# EAGLE design main (EAGLE 9.6.2)
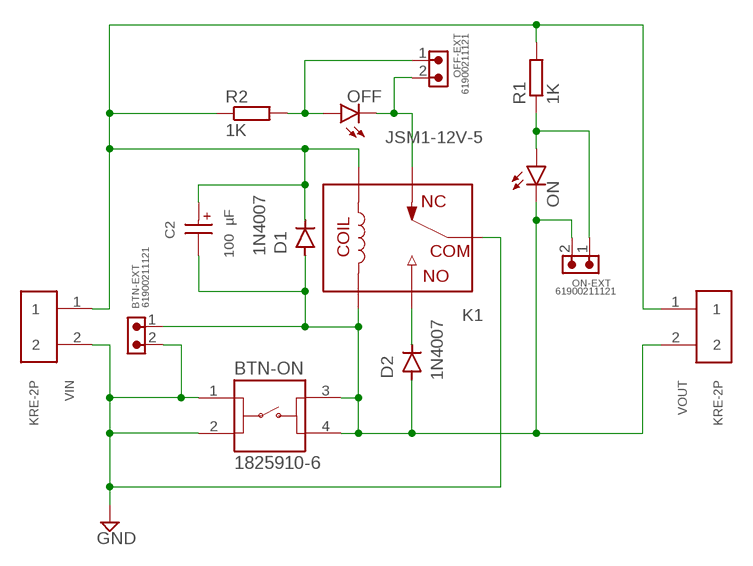
[diagram p0: schematic, sheet 1]

## Parts
BTN-EXT  61900211121  61900211121  [61900211121]
BTN-ON  1825910-6  [1825910-6]
C2  100 µF  WCAP-ATLL_5X11_860160372011  [WCAP-ATLL_5X11(DXL)]
D1  1N4007  [DO-41]
D2  1N4007  [DO-41]
K1  JSM1-12V-5  [JSM1-12V-5]
OFF  LED-CIRCULAR-3MM-VERMELHO  [LED-CIR-3MM-VERMELHO]
OFF-EXT  61900211121  61900211121  [61900211121]
ON  LED-CIRCULAR-3MM-VERDE  [LED-CIR-3MM-VERDE]
ON-EXT  61900211121  61900211121  [61900211121]
R1  1K  R-EU_0207/7  [0207/7]
R2  1K  R-EU_0207/7  [0207/7]
VIN  KRE-2P  [KRE-2P]
VOUT  KRE-2P  [KRE-2P]

## Nets
GND: BTN-EXT.2 BTN-ON.1 BTN-ON.2 K1.1 VIN.2
N$1: BTN-EXT.1 BTN-ON.3 BTN-ON.4 C2.2(-) D1.A D2.A K1.2 ON-EXT.2 ON.K(CATHODE) VOUT.2
N$2: OFF-EXT.1 OFF.A(ANODE) R2.2
N$3: C2.1(+) D1.C K1.5 R1.2 R2.1 VIN.1 VOUT.1
N$4: K1.4 OFF-EXT.2 OFF.K(CATHODE)
N$5: ON-EXT.1 ON.A(ANODE) R1.1
N$6: D2.C K1.3

## Library data of the parts
BTN-EXT OFF-EXT ON-EXT = Wurth_Connectors_WR-WTB:61900211121: WR-WTB 2.54 mm Male Locking Header KIND PROPERTIES: Pitch:2.54 mm Gender:Male MATERIAL PROPERTIES: Insulator Material :PA66 Insulator Flammability Rating:UL94 V-0 Insulator Color:Beige Contact Material:Copper Alloy Contact Plating:Tin Contact Type:Stamped GENERAL INFORMATION Operating Temperature:-40 up to +105 °C Compliance: RoHS Working Voltage:250 V (AC) Withstanding Voltage:1000 V (AC) Contact Resistance:20 mΩ RISO:1000 MΩ CERTIFICATION UL Approval:E323964 PACKAGING PROPERTIES Packaging:Bag <https://katalog.we-online.com/media/images/v2/o33345v209%20Family_WR-WTB_6190xx11121.jpg> Details see: https://katalog.we-online.com/en/em/WTB_2_54_MALE_LOCKING_HEADER_6190XX11121 Updated by Ella Wu 2020-07-08 2020 (C) Würth Elektronik; CONTACT-RESISTANCE: 20mOhm; DATASHEET-URL: https://www.we-online.com/catalog/datasheet/61900211121.pdf; GENDER: Male; L: 5.08mm; MOUNT: THT; PACKAGING: Bag; PART-NUMBER: 61900211121; PCB-CABLE-PANEL: PCB; PINS: 2; PITCH: 2.54mm; TOL-R: max.; TYPE: Vertical; USE-WITH: WR-WTB 2.54 mm Female Terminal Housing; WORKING-VOLTAGE: 250V(AC)
BTN-ON = Switch:1825910-6: SWITCH TACTILE SPST-NO 0.05A 24V Manufacturer's datasheet <https://www.te.com/commerce/DocumentDelivery/DDEController?Action=srchrtrv&DocNm=1825910&DocType=Customer+Drawing&DocLang=English>; CREATED_BY: PCBLayout.com; DIGIKEY_PART_NUMBER: 450-1650-ND; MANUFACTURER: TE Connectivity ALCOSWITCH Switches; MPN: 1825910-6
C2 = Wurth_Capacitors_WCAP-ATLL:WCAP-ATLL_5X11: WCAP-ATLL Aluminum Electrolytic Capacitors Long Life +105 °C Characteristics Long life product series Mounting style: THT Radial Capacitance range: 0.47 µF ‒ 6800 µF Capacitance tolerance: ±20 % Voltage range (UR): 10 ‒ 50 V(DC) Operating temperature: -55 °C up to +105 °C Endurance: 3000 ‒ 10000 h @ +105 °C Dimensions (DxL) in mm: 5.0 x 11.0 up to 18.0 x 35.5 Recommended soldering: Wave soldering Applications Long life application Filtering Smoothing Energy storage Coupling e.g. Switched-mode power supply, AC/DC converter, adapter, charger, digital camera <https://www.we-online.com/catalog/media/o14730v209%20Family_WCAP-ATLL.jpg> Details see: https://www.we-online.com/catalog/en/WCAP-ATLL/ Updated by yingchun,Shan;2020-03-02 2020(C) Würth Elektronik; DATASHEET-URL: https://www.we-online.com/catalog/datasheet/860160372011.pdf; DF: 16%; DIAMETER: 5mm; I-LEAK: 16uA; I-RIPPLE: 228mA; L: 11mm; OPERATING-TEMPERATURE: -55 °C up to +105 °C; PART-NUMBER: 860160372011; PITCH: 2mm; TECHNICAL-REFERENCE: ATEC110101M016DSPA3C000; VR: 16V(DC)
D1 D2 = Diodes:1N4007: DIODE GEN PURP 1KV 1A DO41 Manufacturer's datasheet <https://www.mccsemi.com/pdf/Products/1N4001-1N4007(DO-41).pdf>; CREATED_BY: PCBLayout.com; DIGIKEY_PART_NUMBER: 1N4007MSCT-ND; MANUFACTURER: Micro Commercial Co; MPN: 1N4007; PACKAGE: DO-41
K1 = Relay:JSM1-12V-5: RELAY AUTOMOTIVE SPDT 15A 12V Manufacturer's datasheet <https://media.digikey.com/pdf/Data%20Sheets/Panasonic%20Electric%20Works%20PDFs/JS-M_Series_Rev_Dec_2011.pdf>; CREATED_BY: PCBLayout.com; DIGIKEY_PARTNO: 255-1240-ND; MANUFACTURER: Panasonic Electric Works; MPN: JSM1-12V-5
OFF ON = LED:LED-CIRCULAR-3MM
R1 R2 = resistor:R-EU_: RESISTOR, European symbol
VIN VOUT = kre:KRE-2P: KRE Conector 2P

## Board
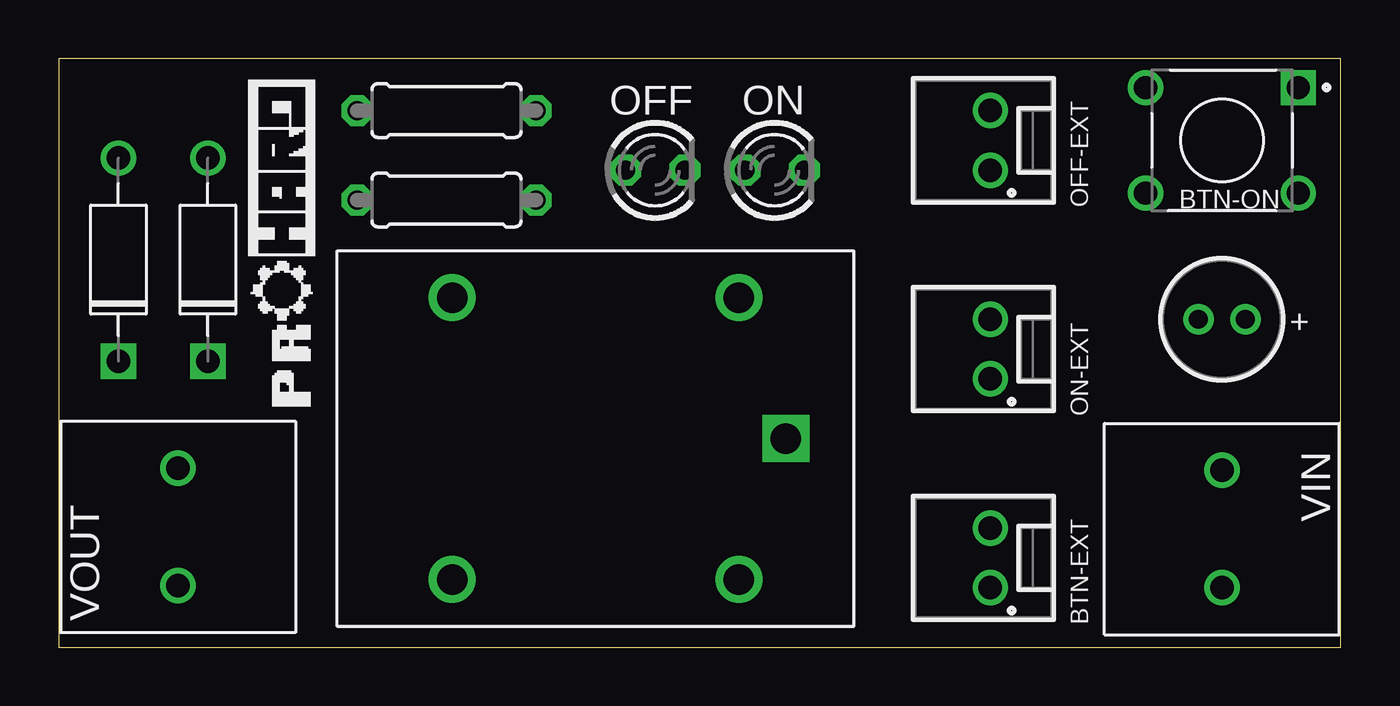
[diagram p1: board, top side]
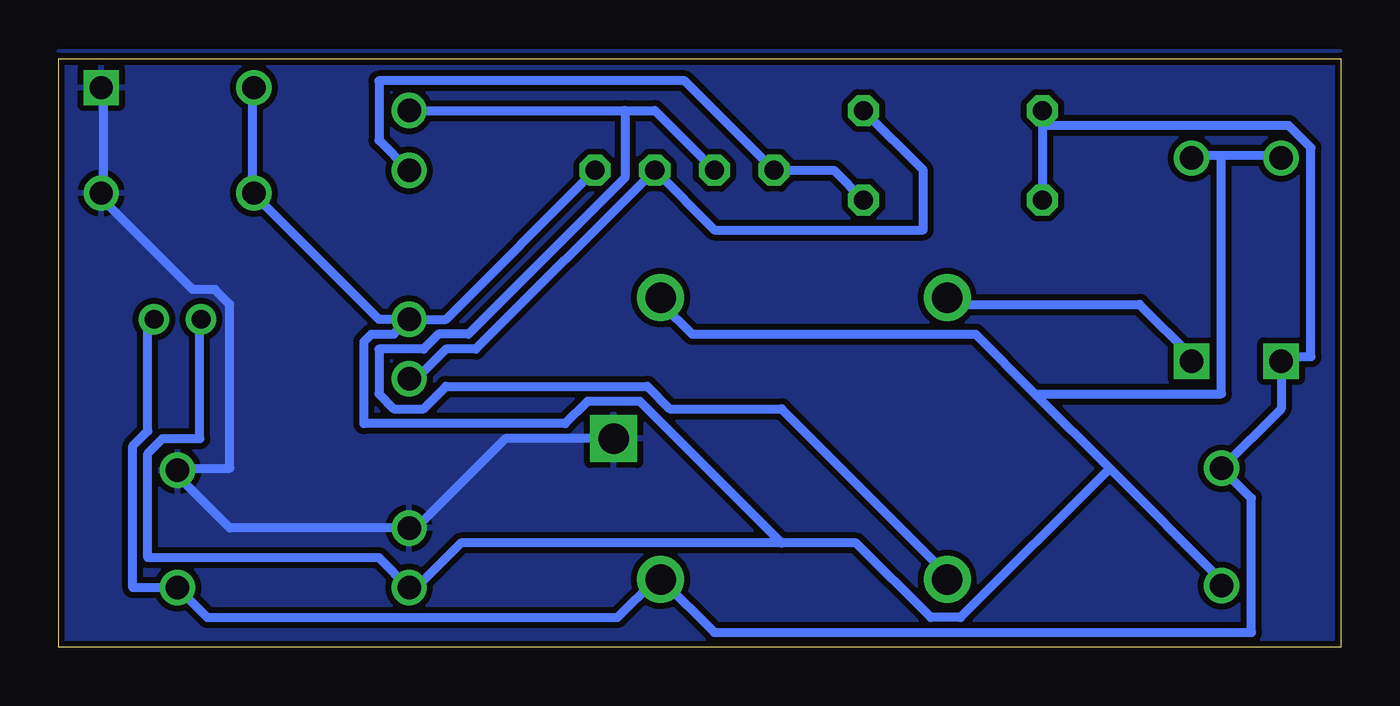
[diagram p2: board, bottom side, seen from below]

Size 54.59 x 25.07 mm. Coordinates in mm from the lower left corner, seen from the top.
Outline: 0,0 54.59,0 54.59,25.07 0,25.07 0,0
Copper layers (1*16): Top 0.035mm / dielectric 1.5mm / Bottom 0.035mm
Design rules "default *": minimum track width 15mil, minimum drill 0.35mm, track to track 10mil, track to pad 10mil, pad to pad 10mil, via to via 10mil, smd to smd 6mil, copper to edge 10mil, drill to drill 10mil, minimum pad ring 10mil, minimum via ring 8mil, stop-mask expansion 4mil, vias tented up to drill 0mil, thermal gap 10mil

### Footprints (pad centres in the part's own frame; a part is rotated, then mirrored left to right if it is on the bottom)
61900211121 = drill 1: 1 1.27,0.3; 2 -1.27,0.3
1825910-6 = drill 0.99 square: 1 3.25,2.25 | drill 0.99: 2 3.25,-2.25; 3 -3.25,2.25; 4 -3.25,-2.25
WCAP-ATLL_5X11(DXL) = drill 0.8: 1 1,0; 2 -1,0
DO-41 = drill 1: A 4.325,0 | drill 1 square: C -4.325,0
JSM1-12V-5 = drill 1.3 pad 2 square: 1 8.1,0 | drill 1.3 pad 2: 2 6.1,6; 3 -6.1,6; 4 -6.1,-6; 5 6.1,-6
LED-CIR-3MM-VERMELHO = drill 0.813 octagon: A -1.27,0; K 1.27,0
LED-CIR-3MM-VERDE = drill 0.813 octagon: A -1.27,0; K 1.27,0
0207/7 = drill 0.813 octagon: 1 -3.81,0; 2 3.81,0
KRE-2P = drill 1: 1 -2.54,0; 2 2.46,0

### Placement (x,y rotation side)
BTN-EXT  39.37,3.81 270 top
BTN-ON  49.53,21.59 0 top
C2  49.53,13.97 0 top
D1  2.54,16.51 90 top
D2  6.35,16.51 90 top
K1  22.86,8.89 0 top
OFF  25.4,20.32 0 top
OFF-EXT  39.37,21.59 270 top
ON  30.48,20.32 0 top
ON-EXT  39.37,12.7 270 top
R1  16.51,22.86 180 top
R2  16.51,19.05 0 top
VIN  49.53,5.08 90 top
VOUT  5.08,5.08 270 top

### Tracks (layer width: path | path; a pad name or v marks a point on that pad's centre or on a via)
GND
  Bottom 0.381: BTN-ON.1 52.7,23.81 52.7,19.37 BTN-ON.2 52.7,19.05 48.9,15.24 47.94,15.24 47.31,14.61 47.31,7.62 49.53,7.62 VIN.2 49.53,7.3 47.31,5.08 BTN-EXT.2 39.37,5.08 35.56,8.89 K1.1
  pour Bottom: 0,25.4 54.61,25.4 54.61,0 0,0
N$1
  Bottom 0.381: BTN-ON.3 46.35,23.81 46.35,19.37 BTN-ON.4 46.04,19.05 40.96,13.97 39.69,13.97 | ON.K 38.1,13.97 ON-EXT.2 39.69,13.97 | C2.2 48.58,13.97 48.58,8.89 50.16,8.89 50.8,8.26 50.8,3.81 40.96,3.81 39.69,2.54 BTN-EXT.1 39.37,2.54 37.47,4.45 23.81,4.45 | 5.08,20.96 6.35,20.96 D2.A | 5.08,20.96 2.54,20.96 D1.A | 13.02,10.8 15.56,13.34 27.62,13.34 28.89,14.61 K1.2 | 13.02,10.8 9.84,7.62 | 9.84,7.62 5.08,2.86 VOUT.2 | 5.08,20.96 5.08,10.8 13.02,10.8 | 23.81,4.45 20.64,4.45 17.46,1.27 16.19,1.27 9.84,7.62 | 39.69,13.97 40.32,13.34 41.27,13.34 41.59,13.02 41.59,9.53 33.02,9.53 32.07,10.48 29.84,10.48 23.81,4.45
N$2
  Bottom 0.381: R2.2 21.59,20.32 OFF.A 27.94,24.13 40.96,24.13 40.96,21.59 39.69,20.32 OFF-EXT.1
N$3
  Bottom 0.381: 12.7,22.23 R2.1 | 12.7,22.23 2.22,22.23 1.27,21.27 1.27,12.38 2.54,12.38 D1.C 2.54,10.16 VOUT.1 3.81,6.35 3.81,0.64 26.67,0.64 28.89,2.86 K1.5 29.21,2.86 30.8,1.27 48.26,1.27 VIN.1 51.44,2.54 51.44,8.57 50.8,9.21 50.8,13.97 C2.1 | 12.7,22.23 R1.2
N$4
  Bottom 0.381: OFF.K 29.21,22.86 30.48,22.86 | OFF-EXT.2 30.48,22.86 | 30.48,22.86 30.48,20 37.15,13.34 38.42,13.34 39.05,12.7 40.96,12.7 40.96,10.8 40.32,10.16 39.05,10.16 38.1,11.11 29.53,11.11 28.57,10.16 23.81,10.16 16.83,3.18 K1.4
N$5
  Bottom 0.381: R1.1 17.78,20.32 17.78,17.78 26.67,17.78 ON.A 36.83,12.7 38.1,12.7 39.37,11.43 ON-EXT.1
N$6
  Bottom 0.381: D2.C 6.35,12.38 8.57,14.61 16.51,14.61 K1.3